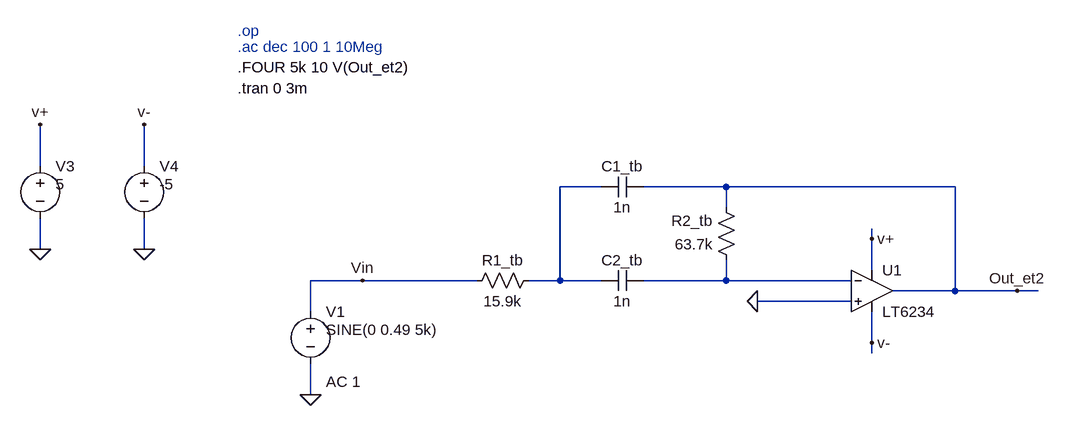
[diagram p0: schematic etaj2.asc]
etaj2.asc, the LTspice schematic file:
Version 4
SHEET 1 2932 1708
WIRE 1088 -16 1088 -80
WIRE 1248 -16 1248 -80
WIRE 1952 16 1888 16
WIRE 2144 16 2016 16
WIRE 2496 16 2144 16
WIRE 2144 48 2144 16
WIRE 2368 96 2368 80
WIRE 1088 112 1088 64
WIRE 1248 112 1248 64
WIRE 2368 144 2368 96
WIRE 1584 160 1504 160
WIRE 1760 160 1584 160
WIRE 1888 160 1888 16
WIRE 1888 160 1840 160
WIRE 1952 160 1888 160
WIRE 2144 160 2144 128
WIRE 2144 160 2016 160
WIRE 2336 160 2144 160
WIRE 2496 176 2496 16
WIRE 2496 176 2400 176
WIRE 2592 176 2496 176
WIRE 2624 176 2592 176
WIRE 2336 192 2192 192
WIRE 1504 208 1504 160
WIRE 2368 256 2368 208
WIRE 2368 272 2368 256
WIRE 1504 336 1504 288
FLAG 1088 112 0
FLAG 1248 112 0
FLAG 1088 -80 v+
FLAG 1248 -80 v-
FLAG 1504 336 0
FLAG 2592 176 Out_et2
FLAG 2368 256 v-
FLAG 2368 96 v+
FLAG 1584 160 Vin
FLAG 2192 192 0
DATAFLAG 1664 160 ""
DATAFLAG 1920 160 ""
DATAFLAG 2192 160 ""
DATAFLAG 2272 192 ""
DATAFLAG 2464 176 ""
SYMBOL voltage 1088 -32 R0
WINDOW 123 24 124 Left 2
WINDOW 39 0 0 Left 2
WINDOW 3 24 44 Left 2
SYMATTR Value 5
SYMATTR InstName V3
SYMBOL voltage 1248 -32 R0
WINDOW 123 24 124 Left 2
WINDOW 39 0 0 Left 2
WINDOW 3 24 44 Left 2
SYMATTR Value -5
SYMATTR InstName V4
SYMBOL voltage 1504 192 R0
WINDOW 123 24 124 Left 2
WINDOW 39 0 0 Left 2
WINDOW 3 24 44 Left 2
SYMATTR Value2 AC 1
SYMATTR Value SINE(0 0.49 5k)
SYMATTR InstName V1
SYMBOL cap 2016 32 M270
WINDOW 0 32 32 VTop 2
WINDOW 3 0 32 VBottom 2
SYMATTR InstName C1_tb
SYMATTR Value 1n
SYMBOL res 1856 144 R90
WINDOW 0 0 56 VBottom 2
WINDOW 3 32 56 VTop 2
SYMATTR InstName R1_tb
SYMATTR Value 15.9k
SYMBOL res 2160 144 R180
WINDOW 0 36 76 Left 2
WINDOW 3 36 40 Left 2
SYMATTR InstName R2_tb
SYMATTR Value 63.7k
SYMBOL cap 1952 176 R270
WINDOW 0 32 32 VTop 2
WINDOW 3 0 32 VBottom 2
SYMATTR InstName C2_tb
SYMATTR Value 1n
SYMBOL OpAmps\\LT6234 2368 176 R0
SYMATTR InstName U1
TEXT 1392 -224 Left 2 ;.op
TEXT 1392 -200 Left 2 ;.ac dec 100 1 10Meg
TEXT 1392 -168 Left 2 !.FOUR 5k 10 V(Out_et2)
TEXT 1392 -136 Left 2 !.tran 0 3m

The netlist it stands for:
* etaj2.asc
V3 v+ 0 5
V4 v- 0 -5
V1 Vin 0 SINE(0 0.49 5k) AC 1
C1_tb Out_et2 N001 1n
R1_tb N001 Vin 15.9k
R2_tb N002 Out_et2 63.7k
C2_tb N001 N002 1n
* U1: LT6234 (symbol OpAmps\LT6234 not available, pins judged from their places): In+=0 In-=N002 V+=v+ V-=v- OUT=Out_et2
* .op
* .ac dec 100 1 10Meg
.FOUR 5k 10 V(Out_et2)
.tran 0 3m
.backanno
.end